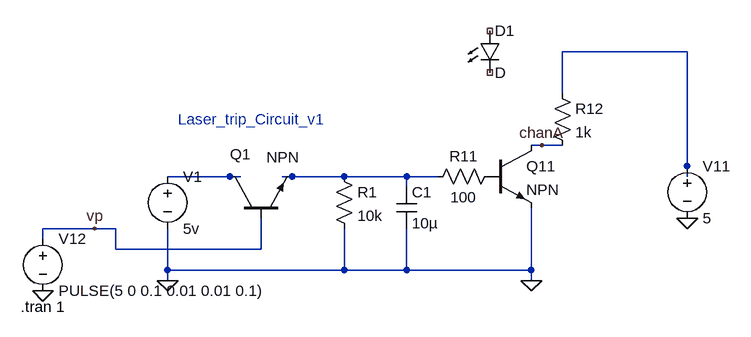
[diagram p0: schematic Laser_trip_circuit_v1.asc]
Laser_trip_circuit_v1.asc, the LTspice schematic file:
Version 4
SHEET 1 2116 2424
WIRE 544 -160 352 -160
WIRE 352 -96 352 -160
WIRE 320 -16 304 -16
WIRE 352 -16 320 -16
WIRE 544 16 544 -160
WIRE -160 32 -256 32
WIRE -144 32 -160 32
WIRE -64 32 -80 32
WIRE 16 32 -64 32
WIRE 112 32 16 32
WIRE 160 32 112 32
WIRE 544 32 544 16
WIRE 112 48 112 32
WIRE -368 112 -448 112
WIRE -336 112 -368 112
WIRE -448 128 -448 112
WIRE -336 144 -336 112
WIRE -112 144 -112 96
WIRE -112 144 -336 144
WIRE -256 176 -256 112
WIRE 16 176 16 112
WIRE 16 176 -256 176
WIRE 112 176 112 112
WIRE 112 176 16 176
WIRE 304 176 304 80
WIRE 304 176 112 176
WIRE -256 192 -256 176
WIRE 304 192 304 176
FLAG -256 192 0
FLAG 544 96 0
FLAG 304 192 0
FLAG -448 208 0
FLAG -368 112 vp
FLAG 320 -16 chanA
SYMBOL voltage -256 16 R0
WINDOW 123 0 0 Left 0
WINDOW 39 0 0 Left 0
SYMATTR InstName V1
SYMATTR Value 5v
SYMBOL res 0 16 R0
SYMATTR InstName R1
SYMATTR Value 10k
SYMBOL npn -160 96 R270
WINDOW 0 98 0 VRight 2
WINDOW 3 94 56 VRight 2
SYMATTR InstName Q1
SYMBOL cap 96 48 R0
SYMATTR InstName C1
SYMATTR Value 10µ
SYMBOL npn 240 -16 R0
SYMATTR InstName Q11
SYMBOL res 336 -112 R0
SYMATTR InstName R12
SYMATTR Value 1k
SYMBOL voltage 544 0 R0
WINDOW 123 0 0 Left 0
WINDOW 39 0 0 Left 0
SYMATTR InstName V11
SYMATTR Value 5
SYMBOL res 256 16 R90
WINDOW 0 0 56 VBottom 2
WINDOW 3 32 56 VTop 2
SYMATTR InstName R11
SYMATTR Value 100
SYMBOL LED 224 -192 R0
SYMATTR InstName D1
SYMBOL voltage -448 112 R0
WINDOW 123 0 0 Left 0
WINDOW 39 0 0 Left 0
SYMATTR InstName V12
SYMATTR Value PULSE(5 0 0.1 0.01 0.01 0.1)
TEXT -240 -56 Left 2 ;Laser_trip_Circuit_v1
TEXT -482 232 Left 2 !.tran 1

The netlist it stands for:
* Laser_trip_circuit_v1.asc
V1 N002 0 5v
R1 N003 0 10k
Q1 N002 vp N003 0 NPN
C1 N003 0 10µ
Q11 chanA P001 0 0 NPN
R12 N001 chanA 1k
V11 N001 0 5
R11 P001 N003 100
D1 NC_01 NC_02 D
V12 vp 0 PULSE(5 0 0.1 0.01 0.01 0.1)
.model D D
.lib standard.dio
.model NPN NPN
.model PNP PNP
.lib standard.bjt
* Laser_trip_Circuit_v1
.tran 1
.backanno
.end